# Altium schematic sheet main.SchDoc
size A4
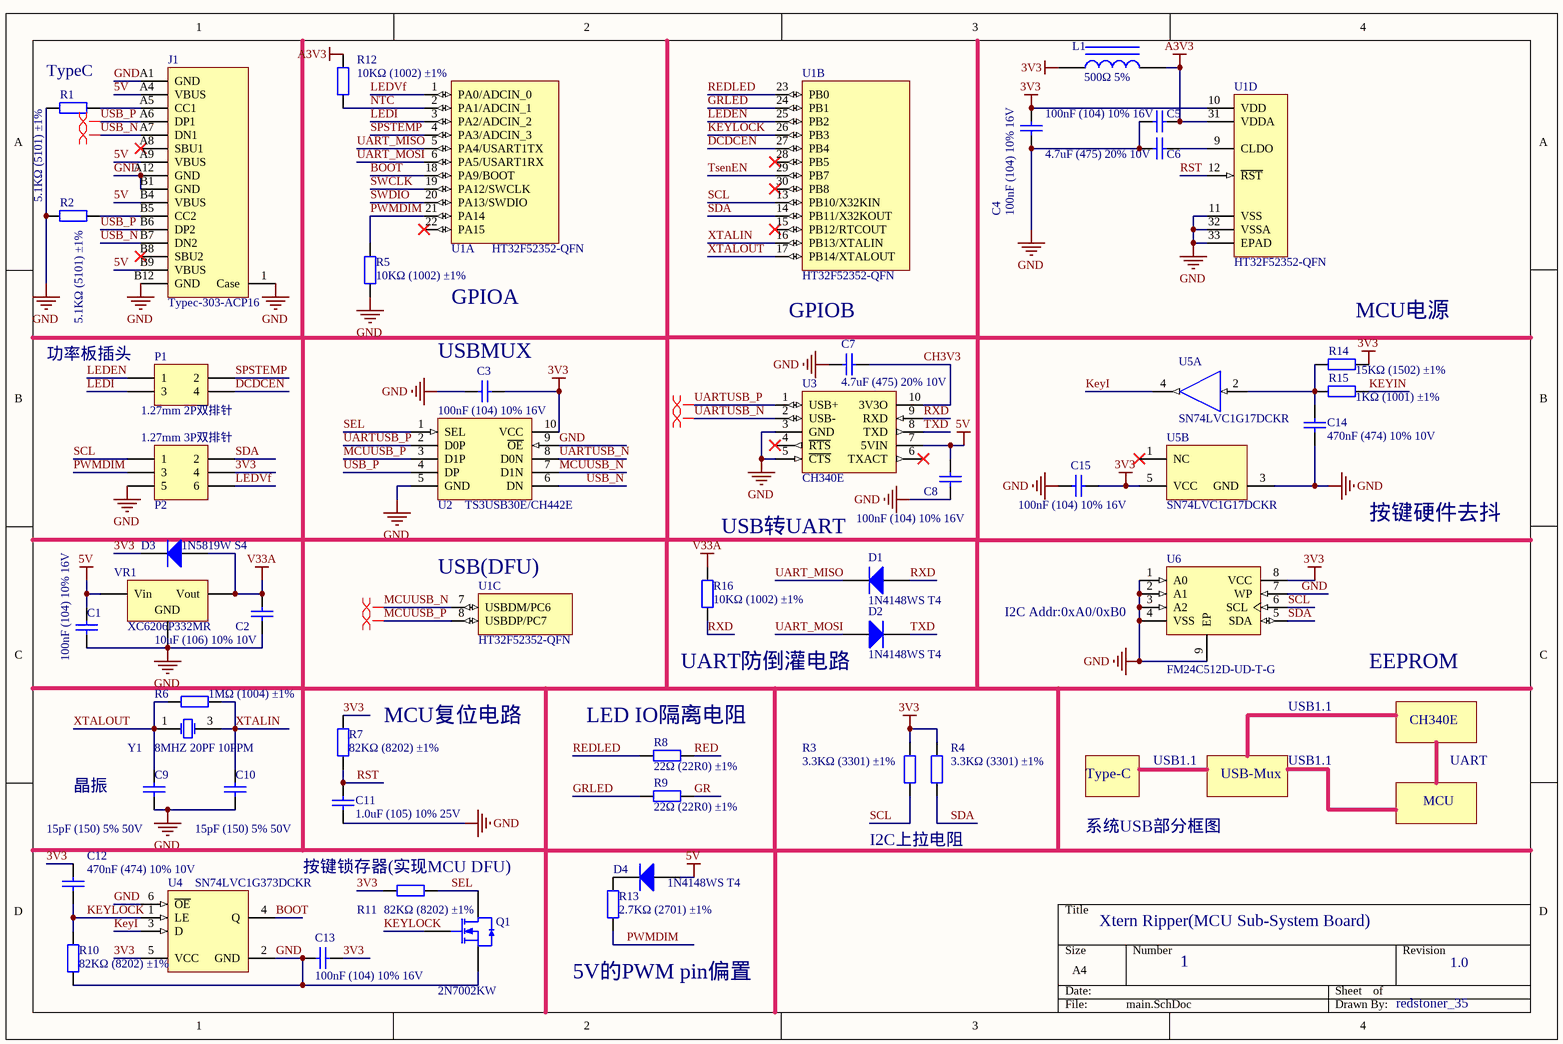
[diagram p0: main.SchDoc]

## Parts
C1  100nF (104) 10% 16V  [0402_C]
C2  10uF (106) 10% 10V  [0603_C]
C3  100nF (104) 10% 16V  [0402_C]
C4  100nF (104) 10% 16V  [0402_C]
C5  100nF (104) 10% 16V  [0402_C]
C6  4.7uF (475) 20% 10V  [0402_C]
C7  4.7uF (475) 20% 10V  [0402_C]
C8  100nF (104) 10% 16V  [0402_C]
C9  15pF (150) 5% 50V  [0402_C]
C10  15pF (150) 5% 50V  [0402_C]
C11  1.0uF (105) 10% 25V  [0402_C]
C12  470nF (474) 10% 10V  [0402_C]
C13  100nF (104) 10% 16V  [0402_C]
C14  470nF (474) 10% 10V  [0402_C]
C15  100nF (104) 10% 16V  [0402_C]
D1  1N4148WS T4  [SOD-323]
D2  1N4148WS T4  [SOD-323]
D3  1N5819W S4  [SOD-323]
D4  1N4148WS T4  [SOD-323]
J1  Typec-303-ACP16  [USB-C-SMD_TYPEC-303-ACP16]
L1  500Ω 5%  [0402_L]
P1  1.27mm 2P双排针  [MHDR2X2]
P2  1.27mm 3P双排针  [MHDR2X3]
Q1  2N7002KW  [SC70-3]
R1  5.1KΩ (5101) ±1%  [0402_R]
R2  5.1KΩ (5101) ±1%  [0402_R]
R3  3.3KΩ (3301) ±1%  [0402_R]
R4  3.3KΩ (3301) ±1%  [0402_R]
R5  10KΩ (1002) ±1%  [0402_R]
R6  1MΩ (1004) ±1%  [0402_R]
R7  82KΩ (8202) ±1%  [0402_R]
R8  22Ω (22R0) ±1%  [0402_R]
R9  22Ω (22R0) ±1%  [0402_R]
R10  82KΩ (8202) ±1%  [0402_R]
R11  82KΩ (8202) ±1%  [0402_R]
R12  10KΩ (1002) ±1%  [0402_R]
R13  2.7KΩ (2701) ±1%  [0402_R]
R14  15KΩ (1502) ±1%  [0402_R]
R15  1KΩ (1001) ±1%  [0402_R]
R16  10KΩ (1002) ±1%  [0402_R]
U1  HT32F52352-QFN  [QFN32-HT32]  (parts A,B,C,D of 4)
U2  TS3USB30E/CH442E  [MSOP-10]
U3  CH340E  [MSOP-10]
U4  SN74LVC1G373DCKR  [DCK0006A_N]
U5  SN74LVC1G17DCKR  [DCK0005A_N]  (parts A,B of 2)
U6  FM24C512D-UD-T-G  [UDFN-8]
VR1  XC6206P332MR  [SOT-23-3L]
Y1  8MHZ 20PF 10PPM  [SMD-3225_4P]

## Nets
3V3: C3.2 C4.2 C12.2 C13.1 C15.2 D3.2(K) L1.1 P2.4 R3.2 R4.2 R7.2 R11.1 R14.1 U1.10(VDD) U2.10(VCC) U4.5(VCC) U5.5(VCC) U6.8(VCC)
5V: C1.2 C8.2 D4.1(A) J1.A4(VBUS) J1.A9(VBUS) J1.B4(VBUS) J1.B9(VBUS) U3.7(5VIN) VR1.3(Vin)
A3V3: C5.1 L1.2 R12.2 U1.31(VDDA)
GND: C1.1 C2.1 C3.1 C4.1 C5.2 C6.2 C7.2 C8.1 C9.1 C10.1 C11.1 C13.2 C14.1 C15.1 J1.1(Case) J1.A1(GND) J1.A12(GND) J1.B1(GND) J1.B12(GND) P2.5 Q1.2(S) R1.1 R2.1 R5.1 R10.1 U1.11(VSS) U1.32(VSSA) U1.33(EPAD) U2.5(GND) U2.9(~{OE}) U3.3(GND) U3.5(~{CTS}) U4.2(GND) U4.6(~{OE}) U5.3(GND) U6.1(A0) U6.2(A1) U6.3(A2) U6.4(VSS) U6.7(WP) U6.9(EP) VR1.1(GND)
V33A: C2.2 D3.1(A) R16.2 VR1.2(Vout)
BOOT: U1.18(PA9/BOOT) U4.4(Q)
CH3V3: C7.1 U3.10(3V3O)
DCDCEN: P1.4 U1.27(PB4)
GR: R9.2
GRLED: R9.1 U1.24(PB1)
KeyI: U4.3(D) U5.4(Y)
KEYIN: R15.2
KEYLOCK: C12.1 Q1.1(G) R10.2 U1.26(PB3) U4.1(LE)
LEDEN: P1.1 U1.25(PB2)
LEDI: P1.3 U1.3(PA2/ADCIN_2)
LEDVf: P2.6 U1.1(PA0/ADCIN_0)
MCUUSB_N: U1.7(USBDM/PC6) U2.7(D1N)
MCUUSB_P: U1.8(USBDP/PC7) U2.3(D1P)
NTC: R12.1 U1.2(PA1/ADCIN_1)
PWMDIM: P2.3 R5.2 R13.1 U1.21(PA14)
RED: R8.2
REDLED: R8.1 U1.23(PB0)
RST: C11.2 R7.1 U1.12(~{RST})
RXD: D1.1(A) R16.1 U3.9(RXD)
SCL: P2.1 R3.1 U1.13(PB10/X32KIN) U6.6(SCL)
SDA: P2.2 R4.1 U1.14(PB11/X32KOUT) U6.5(SDA)
SEL: Q1.3(D) R11.2 U2.1(SEL)
SPSTEMP: P1.2 U1.4(PA3/ADCIN_3)
SWCLK: U1.19(PA12/SWCLK)
SWDIO: U1.20(PA13/SWDIO)
TsenEN: U1.29(PB7)
TXD: D2.2(K) U3.8(TXD)
UART_MISO: D1.2(K) U1.5(PA4/USART1TX)
UART_MOSI: D2.1(A) U1.6(PA5/USART1RX)
UARTUSB_N: U2.8(D0N) U3.2(USB-)
UARTUSB_P: U2.2(D0P) U3.1(USB+)
USB_N: J1.A7(DN1) J1.B7(DN2) U2.6(DN)
USB_P: J1.A6(DP1) J1.B6(DP2) U2.4(DP)
XTALIN: C10.2 R6.2 U1.16(PB13/XTALIN) Y1.3(OSC2)
XTALOUT: C9.2 R6.1 U1.17(PB14/XTALOUT) Y1.1(OSC1)
NetC6_1: C6.1 U1.9(CLDO)
NetC14_2: C14.2 R14.2 R15.1 U5.2(A)
NetD4_2: D4.2(K) R13.2
NetJ1_A5: J1.A5(CC1) R1.2
NetJ1_B5: J1.B5(CC2) R2.2

Not connected (* = marked no-connect by the designer): J1 A8(SBU1)* B8(SBU2)*; U1 15(PB12/RTCOUT)* 22(PA15)* 28(PB5)* 30(PB8)*; U3 4(~{RTS})* 6(TXACT)*; U5 1(NC)*

## Layout directives
differential pair: MCUUSB_N, MCUUSB_P, UARTUSB_N, UARTUSB_P, USB_N, USB_P

## Notes on the sheet
- (near R1) TypeC
- GPIOA
- GPIOB
- (near R14) MCU电源
- 功率板插头
- (near C3) USBMUX
- 按键硬件去抖
- (near U1) USB(DFU)
- USB转UART
- (near U6) I2C Addr:0xA0/0xB0
- (near R7) MCU复位电路
- (near R8) LED IO隔离电阻
- (near R16) UART防倒灌电路
- USB1.1
- EEPROM
- CH340E
- 晶振
- Type-C
- USB-Mux
- UART
- I2C上拉电阻
- 系统USB部分框图
- MCU
- (near R11) 按键锁存器(实现MCU DFU)
- Xtern Ripper(MCU Sub-System Board)
- (near R13) 5V的PWM pin偏置
- 1
- 1.0
- redstoner_35

## Library data of the parts
C1 C3-C5 C8 C13 C15 = 0402 100nF (104) 10% 16V: 贴片电容; ComponentLink1Description: 供应商链接; ComponentLink1URL: http://www.szlcsc.com/product/details_1877.html; Package: 0402; Supplier: LC; SuppliersPartNumber: C1525
C2 = 0603 10uF (106) 10% 10V: 贴片电容; ComponentLink1Description: 供应商链接; ComponentLink1URL: http://www.szlcsc.com/product/details_20411.html; Package: 0603; Supplier: LC; SuppliersPartNumber: C19702
C6 C7 = 0402 4.7uF (475) 20% 10V: 贴片电容; ComponentLink1Description: 供应商链接; ComponentLink1URL: http://www.szlcsc.com/product/details_24469.html; Package: 0402; Supplier: LC; SuppliersPartNumber: C23733
C9 C10 = 0402 15pF (150) 5% 50V: 贴片电容; ComponentLink1Description: 供应商链接; ComponentLink1URL: http://www.szlcsc.com/product/details_1900.html; Package: 0402; Supplier: LC; SuppliersPartNumber: C1548
C11 = 0402 1.0uF (105) 10% 25V: 贴片电容; ComponentLink1Description: 供应商链接; ComponentLink1URL: http://www.szlcsc.com/product/details_53938.html; Package: 0402; Supplier: LC; SuppliersPartNumber: C52923
C12 C14 = 0402 470nF (474) 10% 10V: 贴片电容; ComponentLink1Description: 供应商链接; ComponentLink1URL: http://www.szlcsc.com/product/details_48344.html; Package: 0402; Supplier: LC; SuppliersPartNumber: C47339
D1-D4 = SOD-323 1N4148WS T4: 二极管; ComponentLink1Description: 供应商链接; ComponentLink1URL: http://www.szlcsc.com/product/details_2485.html; Package: SOD-323; Supplier: LC
  D1 D2 D4: SuppliersPartNumber: C2128
  D3: SuppliersPartNumber: C??????
J1 = Type-303-ACP16: 16Pin TypeC 立贴母座
L1 = 0402 10nH 5%: 贴片磁珠; ComponentLink1Description: 供应商链接; ComponentLink1URL: http://www.szlcsc.com/product/details_27896.html; Package: 0402; Supplier: LC; SuppliersPartNumber: C？？？？
P1 = MHDR2X2: Header, 2-Pin, Dual row; LatestRevisionDate: 17-Jul-2002; LatestRevisionNote: Re-released for DXP Platform.; Publisher: Altium Limited
P2 = MHDR2X3: Header, 3-Pin, Dual row; LatestRevisionDate: 17-Jul-2002; LatestRevisionNote: Re-released for DXP Platform.; Publisher: Altium Limited
Q1 = 2N7002 7002: MOS(场效应管); ComponentLink1Description: 供应商链接; ComponentLink1URL: http://www.szlcsc.com/product/details_9040.html; Package: SOT-323; Supplier: LC; SuppliersPartNumber: C???????
R1 R2 = 0402 5.1KΩ (5101) 1%: 贴片电阻; ComponentLink1Description: 供应商链接; ComponentLink1URL: http://www.szlcsc.com/product/details_26648.html; Package: 0402; Supplier: LC; SuppliersPartNumber: C25905
R3 R4 R13 = 0402 3.3KΩ (3301) 1%: 贴片电阻; ComponentLink1Description: 供应商链接; ComponentLink1URL: http://www.szlcsc.com/product/details_26633.html; Package: 0402; Supplier: LC; SuppliersPartNumber: C25890
R5 R12 R16 = 0402 10KΩ (1002) 1%: 贴片电阻; ComponentLink1Description: 供应商链接; ComponentLink1URL: http://www.szlcsc.com/product/details_26487.html; Package: 0402; Supplier: LC; SuppliersPartNumber: C25744
R6 = 0402 1MΩ (1004) 1%: 贴片电阻; ComponentLink1Description: 供应商链接; ComponentLink1URL: http://www.szlcsc.com/product/details_26826.html; Package: 0402; Supplier: LC; SuppliersPartNumber: C26083
R7 R10 = 0402 68KΩ (6802) 1%: 贴片电阻; ComponentLink1Description: 供应商链接; ComponentLink1URL: http://www.szlcsc.com/product/details_37849.html; Package: 0402; Supplier: LC
  R7: SuppliersPartNumber: C?????
  R10: SuppliersPartNumber: C???????
R8 R9 = 0402 22Ω (22R0) 1%: 贴片电阻; ComponentLink1Description: 供应商链接; ComponentLink1URL: http://www.szlcsc.com/product/details_25835.html; Package: 0402; Supplier: LC; SuppliersPartNumber: C25092
R11 = 0402 100KΩ (1003) 1%: 贴片电阻; ComponentLink1Description: 供应商链接; ComponentLink1URL: http://www.szlcsc.com/product/details_26484.html; Package: 0402; Supplier: LC; SuppliersPartNumber: C?????
R14 = 0402 15KΩ (1502) 1%: 贴片电阻; ComponentLink1Description: 供应商链接; ComponentLink1URL: http://www.szlcsc.com/product/details_26499.html; Package: 0402; Supplier: LC; SuppliersPartNumber: C25756
R15 = 0402 1KΩ (1001) 1%: 贴片电阻; ComponentLink1Description: 供应商链接; ComponentLink1URL: http://www.szlcsc.com/product/details_12256.html; Package: 0402; Supplier: LC; SuppliersPartNumber: C11702
U1 = HT32F52352-QFN: Holtek MCU Cortex M0+ 48MHz 128K ROM 16K RAM
U2 = TS3USB30E: Passive SPDT USB2.0 Highspeed switch
U3 = CH340E: USB-TTL UART converter MSOP-10
U4 = SN74LVC1G373DCKR: Single D-Type Latch with 3S Output, DCK0006A, LARGE T&R; Manufacturer: Texas Instruments; VCC(Min)(V): 1.65; VCC(Max)(V): 5.5; Output Type: CMOS; Logic: True; ICC @ Nom Voltage(Max)(mA): 0.01; Input Type: CMOS/TTL; Bits(#): 1; F @ Nom Voltage(Max)(Mhz): 150; Rating: Catalog; Technology Family: LVC; Voltage(Nom)(V): 1.8,2.5,3.3,5; Schmitt Trigger: No; Output Drive (IOL/IOH)(Max)(mA): 32/-32; 3-State Output: Yes; tpd @ Nom Voltage(Max)(ns): 16,7.3,5.4,4; DatasheetVersion: SCES528D; PackageReference: DCK0006A; Supplier 1: Mouser; Supplier Part Number 1: 595-SN74LVC1G373DCKR; Supplier 2: Digi-Key; Supplier Part Number 2: 296-18775-2-ND; Supplier 3: Digi-Key; Supplier Part Number 3: 296-18775-1-ND; Supplier 4: Digi-Key; Supplier Part Number 4: 296-18775-6-ND; Generic Part Number: SN74LVC1G373; Operating Temperature Range(C): -40 to 125,-40 to 85; Sub-Family: D-Type Latch; PartNumber: SN74LVC1G373DCKR; ComponentLink1Description: Manufacturer URL; ComponentLink1URL: http://www.ti.com/; ComponentLink2Description: Datasheet; ComponentLink2URL: http://www.ti.com/lit/ds/symlink/sn74lvc1g373.pdf
U5 = SN74LVC1G17DCKR: Single Schmitt-Trigger Buffer, DCK0005A, LARGE T&R; Manufacturer: Texas Instruments; VCC(Min)(V): 1.65; VCC(Max)(V): 5.5; Output Type: CMOS; ICC @ Nom Voltage(Max)(mA): 0.01; Input Type: CMOS/TTL; Bits(#): 1; F @ Nom Voltage(Max)(Mhz): 150; Rating: Catalog; Technology Family: LVC; Voltage(Nom)(V): 1.8,2.5,3.3,5; Schmitt Trigger: Yes; Output Drive (IOL/IOH)(Max)(mA): 32/-32; tpd @ Nom Voltage(Max)(ns): 11,6.5,5.5,5; Logic: True; Sub-Family: Non-Inverting Buffer/Driver; 3-State Output: No; DatasheetVersion: SCES351V; PackageReference: DCK0005A; Supplier 1: Mouser; Supplier Part Number 1: 595-SN74LVC1G17DCKR; Supplier 2: Digi-Key; Supplier Part Number 2: 296-11934-2-ND; Supplier 3: Digi-Key; Supplier Part Number 3: 296-11934-1-ND; Supplier 4: Digi-Key; Supplier Part Number 4: 296-11934-6-ND; Generic Part Number: SN74LVC1G17; Operating Temperature Range(C): -40 to 125,-40 to 85; PartNumber: SN74LVC1G17DCKR; ComponentLink1Description: Manufacturer URL; ComponentLink1URL: http://www.ti.com/; ComponentLink2Description: Datasheet; ComponentLink2URL: http://www.ti.com/lit/ds/symlink/sn74lvc1g17.pdf
U6 = CAT24C512HU5: 512Kbit 24Serires I2C EEPROM UDFN-8 with UID and OTP Sector
VR1 = SOT-23 XC6206P332MR: 低压差线性稳压(LDO); ComponentLink1Description: 供应商链接; ComponentLink1URL: http://www.szlcsc.com/product/details_5896.html; Package: SOT-23; Supplier: LC; SuppliersPartNumber: C5446
Y1 = SMD-3225_4P  12MHZ 20PF 10PPM: 贴片晶振; ComponentLink1Description: 供应商链接; ComponentLink1URL: http://www.szlcsc.com/product/details_9522.html; Package: SMD-3225_4P; Supplier: LC; SuppliersPartNumber: C9002